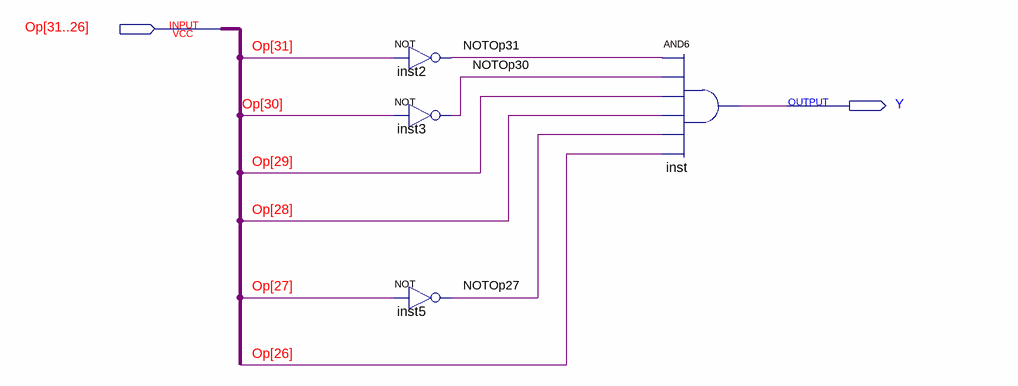
[diagram p0: schematic sheet]
// Quartus schematic ORI.bdf as structural Verilog: 4 symbols, 2 pins
module ORI (
  input  [31:26] Op,
  output Y
);

  wire NOTOp27, NOTOp30, NOTOp31;

  not inst2 (NOTOp31, Op[31]);
  not inst3 (NOTOp30, Op[30]);
  not inst5 (NOTOp27, Op[27]);
  and inst (Y, NOTOp31, NOTOp30, Op[29], Op[28], NOTOp27, Op[26]);
endmodule
